# EAGLE schematic board2side small (EAGLE 7.3.0)
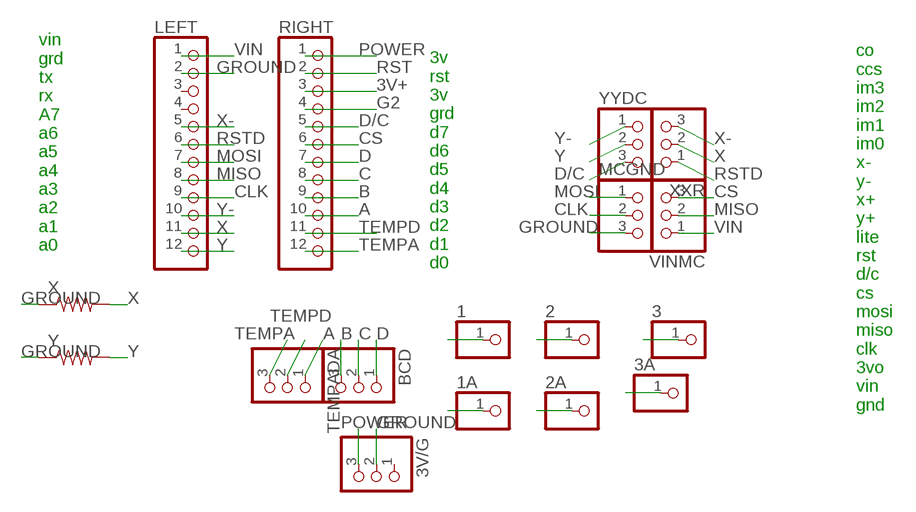
[diagram p0: schematic, sheet 1]

## Parts
1  PINHD-1X1CB  [1X01-CLEANBIG]
1A  PINHD-1X1CB  [1X01-CLEANBIG]
2  PINHD-1X1CB  [1X01-CLEANBIG]
2A  PINHD-1X1CB  [1X01-CLEANBIG]
3  PINHD-1X1CB  [1X01-CLEANBIG]
3A  PINHD-1X1CB  [1X01-CLEANBIG]
3V/G  PINHD-1X3CB  [1X03-CLEANBIG]
BCD  PINHD-1X3CB  [1X03-CLEANBIG]
LEFT  PINHD-1X12-CB  [1X12-CB]
MCGND  PINHD-1X3CB  [1X03-CLEANBIG]
RIGHT  PINHD-1X12-CB  [1X12-CB]
TEMPADA  PINHD-1X3CB  [1X03-CLEANBIG]
VINMC  PINHD-1X3CB  [1X03-CLEANBIG]
X  10KOHM-1/6W-5%(PTH)KIT  [AXIAL-0.3-KIT]
XXR  PINHD-1X3CB  [1X03-CLEANBIG]
Y  10KOHM-1/6W-5%(PTH)KIT  [AXIAL-0.3-KIT]
YYDC  PINHD-1X3CB  [1X03-CLEANBIG]

## Nets
1: 1.1 1A.1
2: 2.1 2A.1
3: 3.1 3A.1
3V+: RIGHT.3
A: RIGHT.10 TEMPADA.1
B: BCD.3 RIGHT.9
C: BCD.2 RIGHT.8
CLK: LEFT.9 MCGND.2
CS: RIGHT.6 VINMC.3
D: BCD.1 RIGHT.7
D/C: RIGHT.5 YYDC.3
G2: RIGHT.4
GROUND: 3V/G.2 LEFT.2 MCGND.3 X.P$1 Y.P$1
MISO: LEFT.8 VINMC.2
MOSI: LEFT.7 MCGND.1
POWER: 3V/G.3 RIGHT.1
RST: RIGHT.2
RSTD: LEFT.6 XXR.1
TEMPA: RIGHT.12 TEMPADA.3
TEMPD: RIGHT.11 TEMPADA.2
VIN: LEFT.1 VINMC.1
X: LEFT.11 X.P$2 XXR.2
X-: LEFT.5 XXR.3
Y: LEFT.12 Y.P$2 YYDC.2
Y-: LEFT.10 YYDC.1
Unconnected: 3V/G.1 LEFT.3 LEFT.4

## Notes on the sheet
- vin
  grd
  tx
  rx
  A7
  a6
  a5
  a4
  a3
  a2
  a1
  a0
- 3v
  rst
  3v
  grd
  d7
  d6
  d5
  d4
  d3
  d2
  d1
  d0
- co
  ccs
  im3
  im2
  im1
  im0
  x-
  y-
  x+
  y+
  lite
  rst
  d/c
  cs
  mosi
  miso
  clk
  3vo
  vin
  gnd

## Library data of the parts
1 1A 2 2A 3 3A = adafruit:PINHD-1X1: Pin header 1x1 for 0.1" spacing With round pins
3V/G BCD MCGND TEMPADA VINMC XXR YYDC = adafruit:PINHD-1X3: PIN HEADER
LEFT RIGHT = adafruit:PINHD-1X12: PIN HEADER
X Y = SparkFun-Resistors:10KOHM-1/6W-5%(PTH): RES-08375; PROD_ID: RES-08375